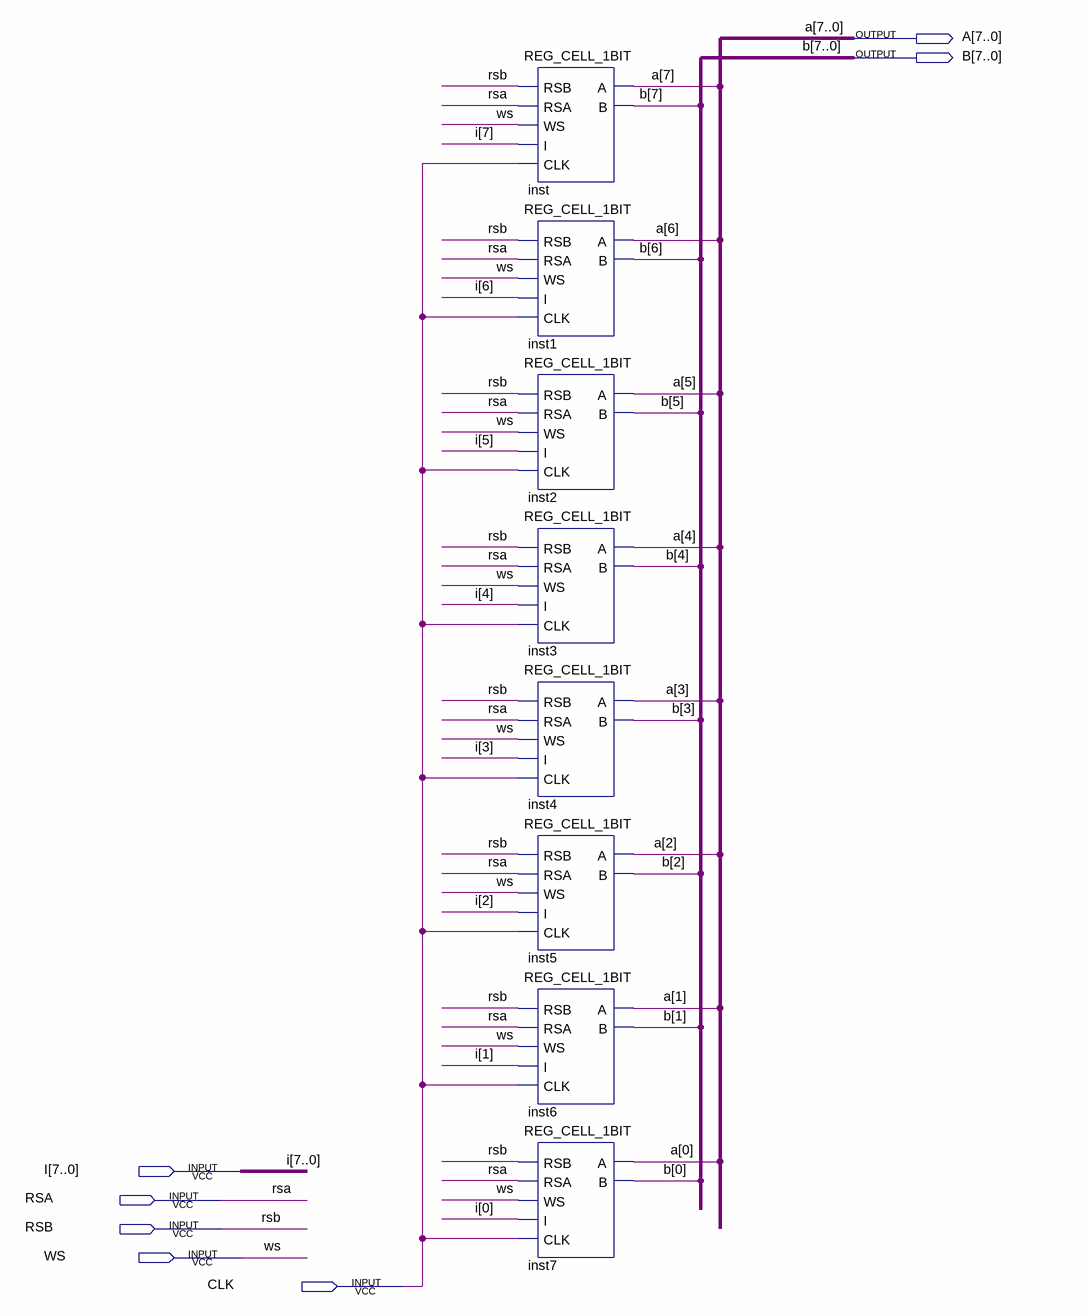
[diagram p0: schematic sheet]
// Quartus schematic REG_CELL_8BIT.bdf as structural Verilog: 8 symbols, 7 pins
module REG_CELL_8BIT (
  input  [7:0] I,
  input  RSA,
  input  RSB,
  input  WS,
  input  CLK,
  output [7:0] A,
  output [7:0] B
);

  REG_CELL_1BIT inst (.RSB(RSB), .RSA(RSA), .WS(WS), .I(I[7]), .CLK(CLK), .A(A[7]), .B(B[7]));
  REG_CELL_1BIT inst1 (.RSB(RSB), .RSA(RSA), .WS(WS), .I(I[6]), .CLK(CLK), .A(A[6]), .B(B[6]));
  REG_CELL_1BIT inst2 (.RSB(RSB), .RSA(RSA), .WS(WS), .I(I[5]), .CLK(CLK), .A(A[5]), .B(B[5]));
  REG_CELL_1BIT inst3 (.RSB(RSB), .RSA(RSA), .WS(WS), .I(I[4]), .CLK(CLK), .A(A[4]), .B(B[4]));
  REG_CELL_1BIT inst4 (.RSB(RSB), .RSA(RSA), .WS(WS), .I(I[3]), .CLK(CLK), .A(A[3]), .B(B[3]));
  REG_CELL_1BIT inst5 (.RSB(RSB), .RSA(RSA), .WS(WS), .I(I[2]), .CLK(CLK), .A(A[2]), .B(B[2]));
  REG_CELL_1BIT inst6 (.RSB(RSB), .RSA(RSA), .WS(WS), .I(I[1]), .CLK(CLK), .A(A[1]), .B(B[1]));
  REG_CELL_1BIT inst7 (.RSB(RSB), .RSA(RSA), .WS(WS), .I(I[0]), .CLK(CLK), .A(A[0]), .B(B[0]));
endmodule
